# EAGLE schematic Charger Shutdown (EAGLE 9.6.2)
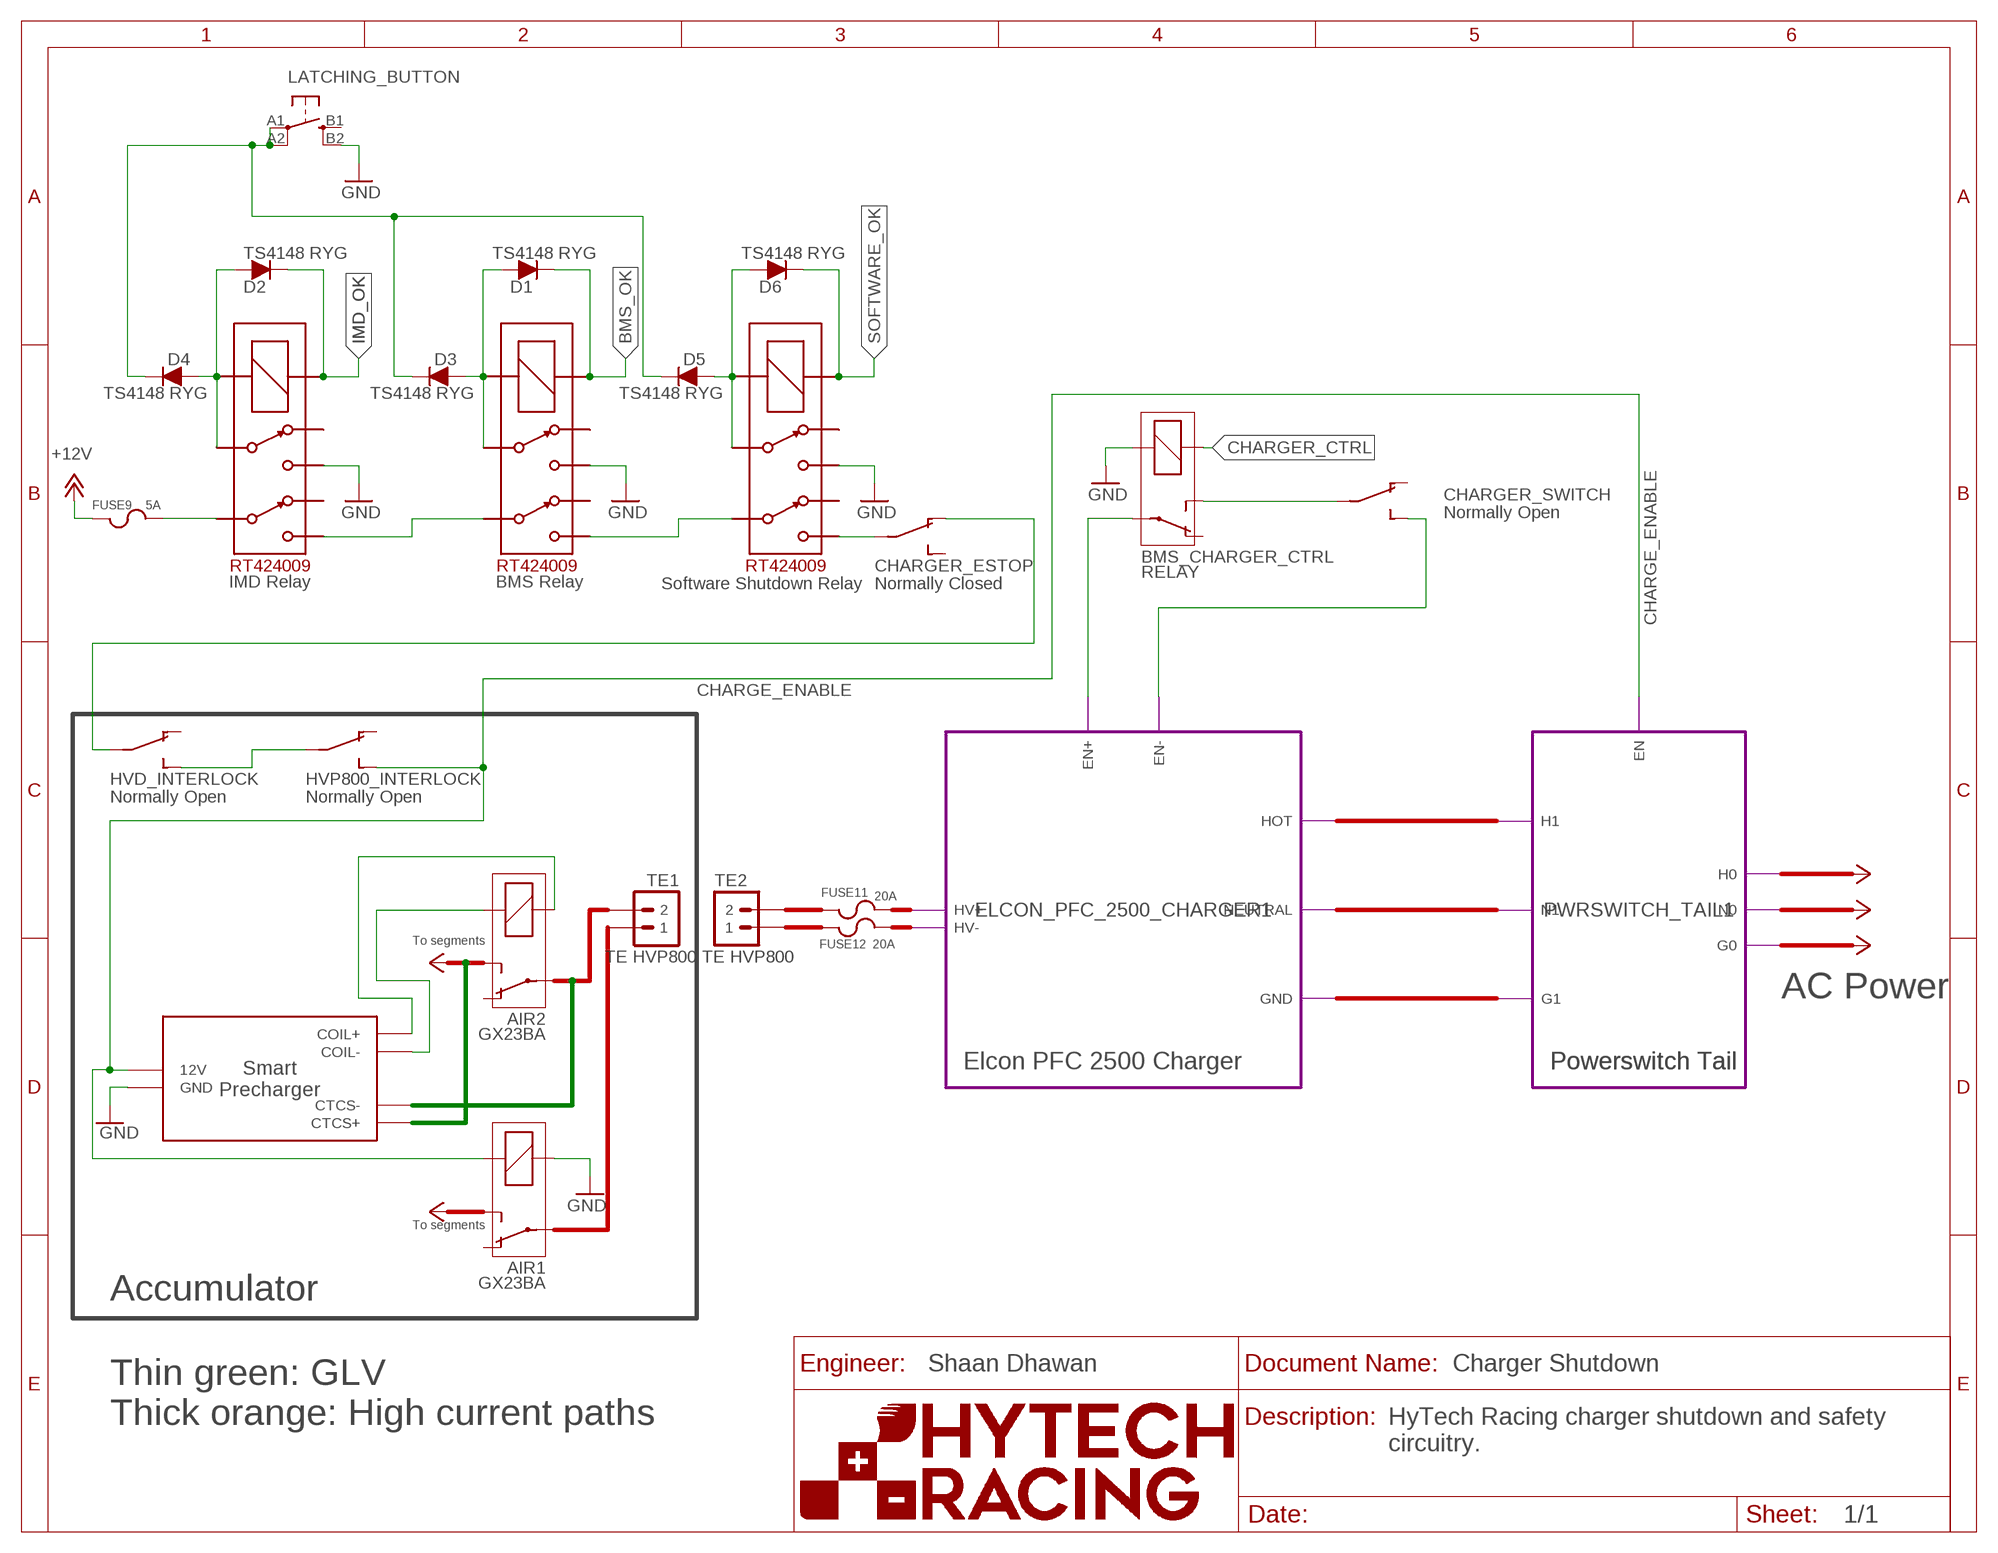
[diagram p0: schematic, sheet 1]
U$1 (FRAME_A_L): ORIENTATION: LANDSCAPE; SIZE: A

## Parts
AIR1  GX23BA  RELAY  (no package)
AIR2  GX23BA  RELAY  (no package)
BMS_CHARGER_CTRL  RELAY  (no package)
CHARGER_ESTOP  Normally Closed  SWITCH_SPST  (no package)
CHARGER_SWITCH  Normally Open  SWITCH_SPST  (no package)
D1  TS4148 RYG  DIODE0805  [0805_D]
D2  TS4148 RYG  DIODE0805  [0805_D]
D3  TS4148 RYG  DIODE0805  [0805_D]
D4  TS4148 RYG  DIODE0805  [0805_D]
D5  TS4148 RYG  DIODE0805  [0805_D]
D6  TS4148 RYG  DIODE0805  [0805_D]
FUSE9  5A  FUSE  (no package)
FUSE11  20A  FUSE  (no package)
FUSE12  20A  FUSE  (no package)
HVD_INTERLOCK  Normally Open  SWITCH_SPST  (no package)
HVP800_INTERLOCK  Normally Open  SWITCH_SPST  (no package)
IMD  RT424009  [RELAY_DPDT]
LATCHING_BUTTON  BTN_10-XXSMD  [TACTILE_SWITCH_SMD_6.2MM_TALL]
TE1  TE HVP800  M02  (no package)
TE2  TE HVP800  M02  (no package)
U$2  RT424009  [RELAY_DPDT]
U$3  RT424009  [RELAY_DPDT]
U$4  SMART_PRECHARGER  (no package)

## Module instances
ELCON_PFC_2500_CHARGER1 = ELCON_PFC_2500_CHARGER
PWRSWITCH_TAIL1 = PWRSWITCH_TAIL

## Nets
+12V: FUSE9.1
BMS_OK: D1.C U$2.COIL+
CHARGE_ENABLE: AIR1.1 HVP800_INTERLOCK.S U$4.12V ; port PWRSWITCH_TAIL1.EN
CHARGER_CTRL: BMS_CHARGER_CTRL.1
GND: AIR1.2 BMS_CHARGER_CTRL.2 IMD.4 LATCHING_BUTTON.B2(S1) U$2.4 U$3.4 U$4.GND
IMD_OK: D2.C IMD.COIL+
N$1: D1.A D3.A U$2.3 U$2.COIL-
N$2: FUSE9.2 IMD.6
N$3: D2.A D4.A IMD.3 IMD.COIL-
N$4: HVD_INTERLOCK.S HVP800_INTERLOCK.P
N$5: IMD.5 U$2.6
N$6: D3.C D4.C D5.C LATCHING_BUTTON.A1(P) LATCHING_BUTTON.A2(P1)
N$8: CHARGER_ESTOP.O HVD_INTERLOCK.P
N$9: CHARGER_ESTOP.P U$3.5
N$10: AIR2.1 U$4.COIL-
N$11: AIR2.2 U$4.COIL+
N$12: U$4.CTCS-
N$13: U$2.5 U$3.6
N$14: U$4.CTCS+
N$15: BMS_CHARGER_CTRL.P ; port ELCON_PFC_2500_CHARGER1.EN+
N$16: BMS_CHARGER_CTRL.S CHARGER_SWITCH.P
N$17: D5.A D6.A U$3.3 U$3.COIL-
N$18: CHARGER_SWITCH.S ; port ELCON_PFC_2500_CHARGER1.EN-
SOFTWARE_OK: D6.C U$3.COIL+
Unconnected: AIR1.O AIR1.P AIR1.S AIR2.O AIR2.P AIR2.S BMS_CHARGER_CTRL.O CHARGER_ESTOP.S CHARGER_SWITCH.O FUSE11.1 FUSE11.2 FUSE12.1 FUSE12.2 HVD_INTERLOCK.O HVP800_INTERLOCK.O IMD.2 IMD.7 LATCHING_BUTTON.B1(S) TE1.1 TE1.2 TE2.1 TE2.2 U$2.2 U$2.7 U$3.2 U$3.7

## Notes on the sheet
- IMD Relay | BMS Relay | Software Shutdown Relay
- To segments
- AC Power
- Elcon PFC 2500 Charger | Powerswitch Tail | Powerswitch Tail
- To segments
- Accumulator
- Shaan Dhawan
- Thin green: GLV
  Thick orange: High current paths
- HyTech Racing charger shutdown and safety 
  circuitry.

## Library data of the parts
AIR1 AIR2 BMS_CHARGER_CTRL = HyTechSymbols:RELAY: RELAY 1 x switch
CHARGER_ESTOP CHARGER_SWITCH HVD_INTERLOCK HVP800_INTERLOCK = HyTechSymbols:SWITCH_SPST: Single Pull Single Throw Switch
D1-D6 = HyTechDevices:DIODE: DIODE general purpose rectifier
FUSE9 FUSE11 FUSE12 = HyTechSymbols:FUSE: Generic Fuse
IMD U$2 U$3 = HyTechDevices:RT424009: TE/Schrack Double Pull Double Throw Relay 9VDC Datasheet <https://www.mouser.com/datasheet/2/418/NG_DS_RT2_1014-736201.pdf> Product Page <https://www.te.com/usa-en/product-6-1393243-2.html>
LATCHING_BUTTON = HyTechDevices:BTN_10-XX: Small momentary tactile push button
TE1 TE2 = HyTechSymbols:M02: Generic 2-pin connector
U$4 = HyTechSymbols:SMART_PRECHARGER: Smart Precharger http://www.zeva.com.au/Products/datasheets/SmartPrechargerV1-3.pdf

## Module ACCUMULATOR
Ports: 

### Library data of the parts

## Module ELCON_PFC_2500_CHARGER
Ports: HV+(io) HV-(io) HOT(io) NEUTRAL(io) GND(io) EN+(io) EN-(io)

### Library data of the parts

## Module PWRSWITCH_TAIL
Ports: H1(io) N1(io) G1(io) H0(io) N0(io) G0(io) EN(io)

### Library data of the parts